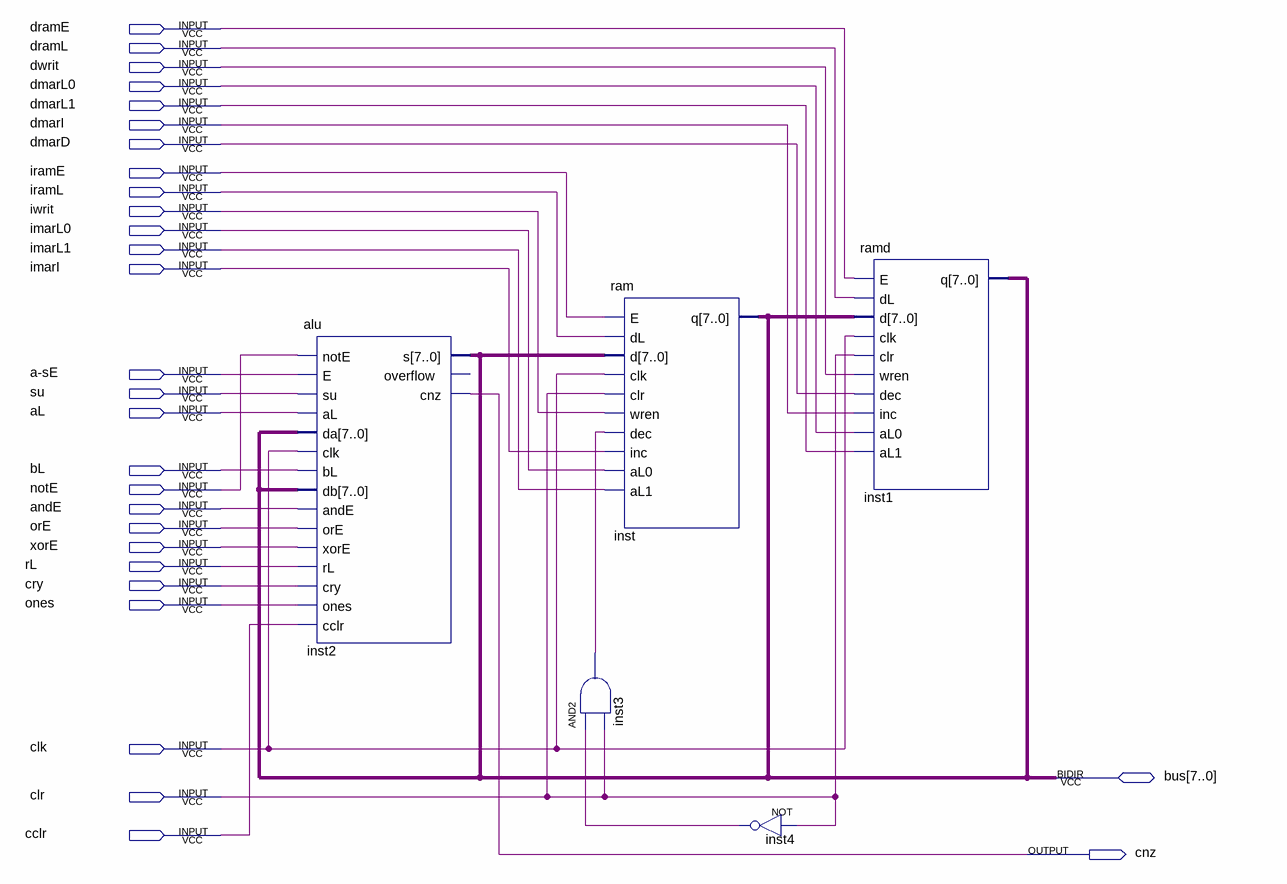
[diagram p0: schematic sheet]
// Quartus schematic link1.bdf as structural Verilog: 5 symbols, 29 pins
module link1 (
  input  dramE,
  input  dramL,
  input  dwrit,
  input  dmarL0,
  input  dmarL1,
  input  dmarI,
  input  dmarD,
  input  iramE,
  input  iramL,
  input  iwrit,
  input  imarL0,
  input  imarL1,
  input  imarI,
  input  \a-sE ,
  input  su,
  input  aL,
  input  bL,
  input  notE,
  input  andE,
  input  orE,
  input  xorE,
  input  rL,
  input  cry,
  input  ones,
  input  clk,
  input  clr,
  input  cclr,
  inout  [7:0] bus,
  output cnz
);

  wire inst3_out, inst4_out;

  alu inst2 (
    .notE(notE), .E(\a-sE ), .su(su), .aL(aL), .da(bus), .clk(clk), .bL(bL), .db(bus), .andE(andE),
    .orE(orE), .xorE(xorE), .rL(rL), .cry(cry), .ones(ones), .cclr(cclr), .s(bus), .cnz(cnz));  // open: overflow
  and inst3 (inst3_out, inst4_out, clr);
  ram inst (
    .E(iramE), .dL(iramL), .d(bus), .clk(clk), .clr(clr), .wren(iwrit), .dec(inst3_out), .inc(imarI),
    .aL0(imarL0), .aL1(imarL1), .q(bus));
  not inst4 (inst4_out, clr);
  ramd inst1 (
    .E(dramE), .dL(dramL), .d(bus), .clk(clk), .clr(clr), .wren(dwrit), .dec(dmarD), .inc(dmarI),
    .aL0(dmarL0), .aL1(dmarL1), .q(bus));
endmodule
